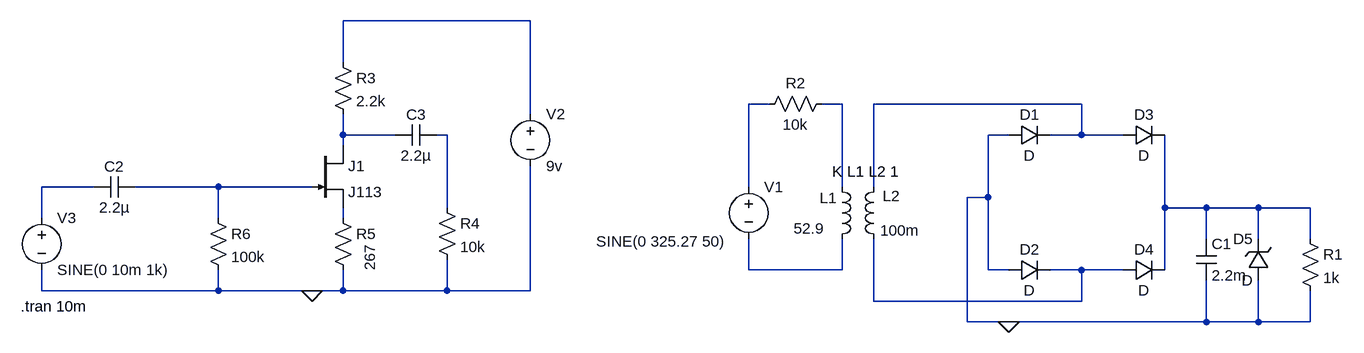
[diagram p0: schematic FullWvrect.asc]
FullWvrect.asc, the LTspice schematic file:
Version 4.1
SHEET 1 992 680
WIRE -320 -144 -608 -144
WIRE -608 -80 -608 -144
WIRE 48 -16 16 -16
WIRE 160 -16 128 -16
WIRE 528 -16 208 -16
WIRE -320 0 -320 -144
WIRE -608 32 -608 0
WIRE -528 32 -608 32
WIRE -448 32 -464 32
WIRE 416 32 384 32
WIRE 528 32 528 -16
WIRE 528 32 480 32
WIRE 592 32 528 32
WIRE -608 48 -608 32
WIRE -992 112 -1072 112
WIRE -800 112 -928 112
WIRE -656 112 -800 112
WIRE 16 112 16 -16
WIRE 160 112 160 -16
WIRE 208 112 208 -16
WIRE 384 128 384 32
WIRE 384 128 352 128
WIRE -448 144 -448 32
WIRE 656 144 656 32
WIRE 720 144 656 144
WIRE 800 144 720 144
WIRE 880 144 800 144
WIRE -1072 160 -1072 112
WIRE -800 160 -800 112
WIRE -608 160 -608 144
WIRE 720 192 720 144
WIRE 800 192 800 144
WIRE 880 192 880 144
WIRE 16 240 16 192
WIRE 160 240 160 192
WIRE 160 240 16 240
WIRE 384 240 384 128
WIRE 416 240 384 240
WIRE 528 240 480 240
WIRE 592 240 528 240
WIRE 656 240 656 144
WIRE -1072 272 -1072 240
WIRE -800 272 -800 240
WIRE -800 272 -1072 272
WIRE -656 272 -800 272
WIRE -608 272 -608 240
WIRE -608 272 -656 272
WIRE -448 272 -448 224
WIRE -448 272 -608 272
WIRE -320 272 -320 80
WIRE -320 272 -448 272
WIRE 208 288 208 192
WIRE 528 288 528 240
WIRE 528 288 208 288
WIRE 352 320 352 128
WIRE 416 320 352 320
WIRE 720 320 720 256
WIRE 720 320 416 320
WIRE 800 320 800 256
WIRE 800 320 720 320
WIRE 880 320 880 272
WIRE 880 320 800 320
FLAG 416 320 0
FLAG -656 272 0
SYMBOL voltage 16 96 R0
WINDOW 3 -235 100 Left 2
WINDOW 123 0 0 Left 0
WINDOW 39 0 0 Left 0
SYMATTR Value SINE(0 325.27 50)
SYMATTR InstName V1
SYMBOL ind 144 96 R0
WINDOW 0 -19 33 Left 2
WINDOW 3 -59 80 Left 2
SYMATTR InstName L1
SYMATTR Value 52.9
SYMBOL ind 224 208 R180
WINDOW 0 -25 82 Left 2
WINDOW 3 -55 29 Left 2
SYMATTR InstName L2
SYMATTR Value 100m
SYMBOL diode 416 48 R270
WINDOW 0 32 32 VTop 2
WINDOW 3 0 32 VBottom 2
SYMATTR InstName D1
SYMBOL diode 416 256 R270
WINDOW 0 32 32 VTop 2
WINDOW 3 0 32 VBottom 2
SYMATTR InstName D2
SYMBOL diode 592 48 R270
WINDOW 0 32 32 VTop 2
WINDOW 3 0 32 VBottom 2
SYMATTR InstName D3
SYMBOL diode 592 256 R270
WINDOW 0 32 32 VTop 2
WINDOW 3 0 32 VBottom 2
SYMATTR InstName D4
SYMBOL res 144 -32 R90
WINDOW 0 0 56 VBottom 2
WINDOW 3 32 56 VTop 2
SYMATTR InstName R2
SYMATTR Value 10k
SYMBOL cap 704 192 R0
SYMATTR InstName C1
SYMATTR Value 2.2m
SYMBOL zener 816 256 R180
WINDOW 0 24 64 Left 2
WINDOW 3 24 0 Left 2
SYMATTR InstName D5
SYMBOL njf -656 48 R0
SYMATTR InstName J1
SYMATTR Value J113
SYMBOL res -624 -96 R0
SYMATTR InstName R3
SYMATTR Value 2.2k
SYMBOL voltage -1072 144 R0
WINDOW 123 0 0 Left 0
WINDOW 39 0 0 Left 0
SYMATTR InstName V3
SYMATTR Value SINE(0 10m 1k)
SYMBOL cap -928 96 R90
WINDOW 0 0 32 VBottom 2
WINDOW 3 32 32 VTop 2
SYMATTR InstName C2
SYMATTR Value 2.2µ
SYMBOL cap -464 16 R90
WINDOW 0 0 32 VBottom 2
WINDOW 3 32 32 VTop 2
SYMATTR InstName C3
SYMATTR Value 2.2µ
SYMBOL res -464 128 R0
SYMATTR InstName R4
SYMATTR Value 10k
SYMBOL res -624 144 R0
WINDOW 3 57 97 VLeft 2
SYMATTR InstName R5
SYMATTR Value 267
SYMBOL res -816 144 R0
SYMATTR InstName R6
SYMATTR Value 100k
SYMBOL voltage -320 -16 R0
WINDOW 123 0 0 Left 0
WINDOW 39 0 0 Left 0
SYMATTR InstName V2
SYMATTR Value 9v
SYMBOL res 864 176 R0
SYMATTR InstName R1
SYMATTR Value 1k
TEXT 144 88 Left 2 !K L1 L2 1
TEXT -1104 296 Left 2 !.tran 10m

The netlist it stands for:
* FullWvrect.asc
V1 N002 N011 SINE(0 325.27 50)
L1 N003 N011 52.9
L2 N012 N004 100m
D1 0 N004 D
D2 0 N012 D
D3 N004 N009 D
D4 N012 N009 D
R2 N003 N002 10k
C1 N009 0 2.2m
D5 0 N009 D
J1 N005 N008 N010 J113
R3 N001 N005 2.2k
V3 N007 0 SINE(0 10m 1k)
C2 N008 N007 2.2µ
C3 N006 N005 2.2µ
R4 N006 0 10k
R5 N010 0 267
R6 N008 0 100k
V2 N001 0 9v
R1 N009 0 1k
.model D D
.lib standard.dio
.model NJF NJF
.model PJF PJF
.lib standard.jft
K L1 L2 1
.tran 10m
.backanno
.end